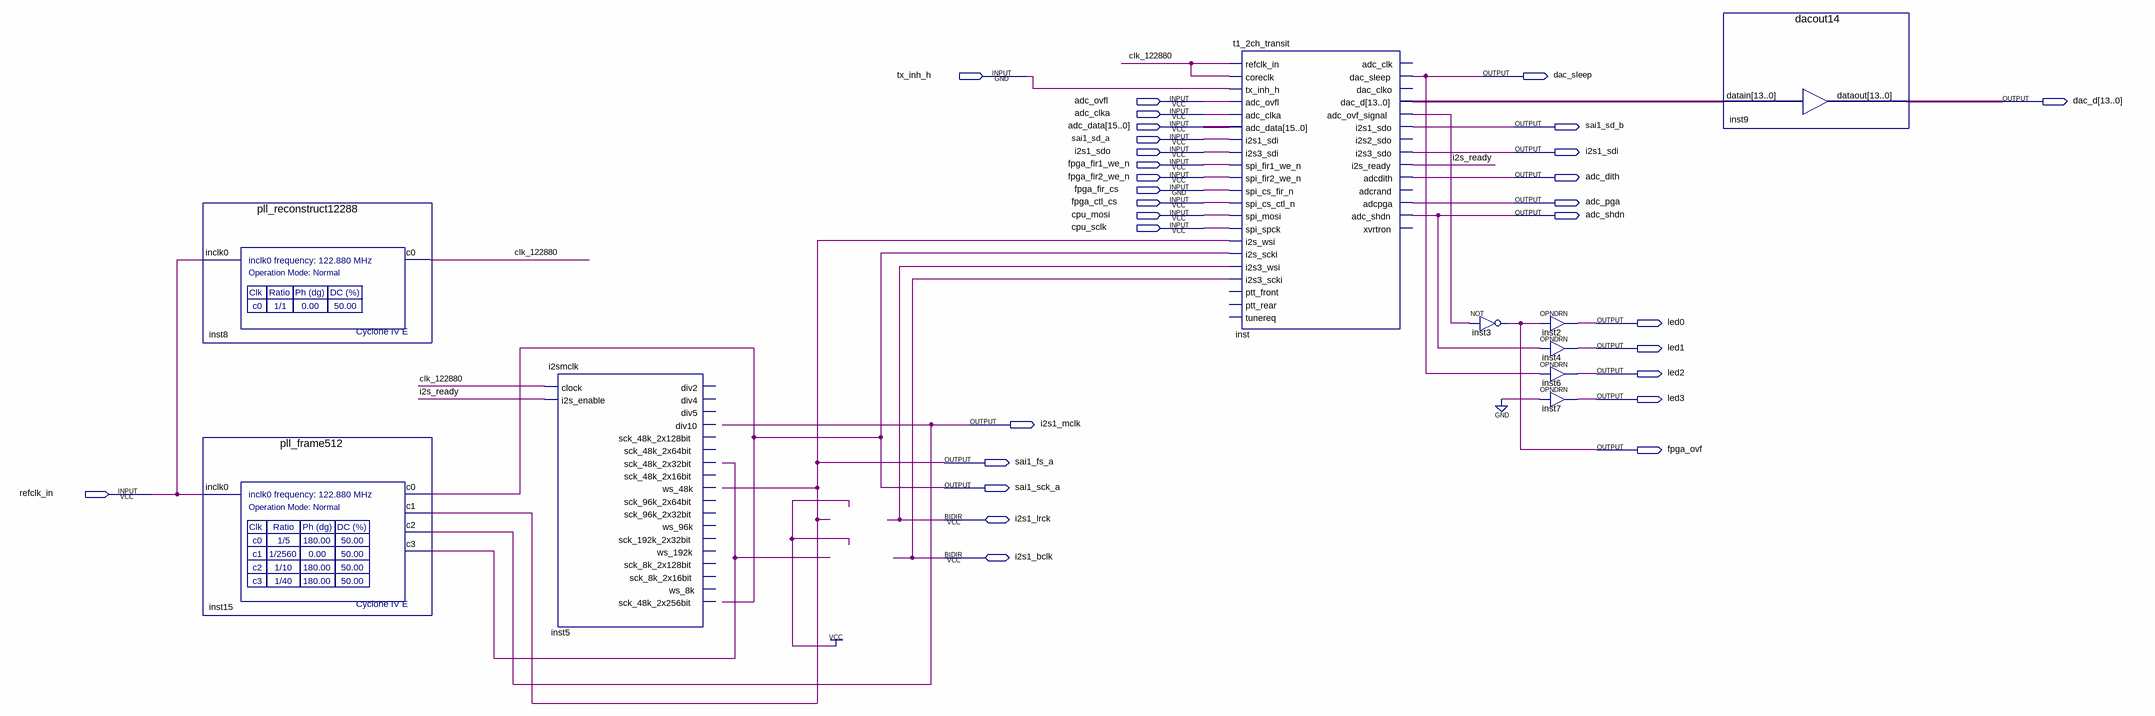
[diagram p0: schematic sheet]
// Quartus schematic tc1_top_veloci_v0.bdf as structural Verilog: 10 symbols, 30 pins
module tc1_top_veloci_v0 (
  input  tx_inh_h,
  input  adc_ovfl,
  input  adc_clka,
  input  [15:0] adc_data,
  input  sai1_sd_a,
  input  i2s1_sdo,
  input  fpga_fir1_we_n,
  input  fpga_fir2_we_n,
  input  fpga_fir_cs,
  input  fpga_ctl_cs,
  input  cpu_mosi,
  input  cpu_sclk,
  input  refclk_in,
  inout  i2s1_lrck,
  inout  i2s1_bclk,
  output dac_sleep,
  output [13:0] dac_d,
  output sai1_sd_b,
  output i2s1_sdi,
  output adc_dith,
  output adc_pga,
  output adc_shdn,
  output led0,
  output led1,
  output led2,
  output led3,
  output i2s1_mclk,
  output fpga_ovf,
  output sai1_fs_a,
  output sai1_sck_a
);

  wire clk_122880, i2s_ready, inst15_c3, inst_adc_ovf_signal;
  wire [13:0] inst_dac_d;

  pll_reconstruct12288 inst8 (.inclk0(refclk_in), .c0(clk_122880));
  pll_frame512 inst15 (.inclk0(refclk_in), .c0(sai1_sck_a), .c1(sai1_fs_a), .c2(i2s1_mclk), .c3(inst15_c3));
  i2smclk inst5 (
    .clock(clk_122880), .i2s_enable(i2s_ready));  // open: div2, div4, div5, div10, sck_48k_2x128bit, sck_48k_2x64bit, sck_48k_2x32bit, sck_48k_2x16bit, ws_48k, sck_96k_2x64bit, sck_96k_2x32bit, ws_96k, sck_192k_2x32bit, ws_192k, sck_8k_2x128bit, sck_8k_2x16bit, ws_8k, sck_48k_2x256bit
  t1_2ch_transit inst (
    .refclk_in(clk_122880), .coreclk(clk_122880), .tx_inh_h(tx_inh_h), .adc_ovfl(adc_ovfl),
    .adc_clka(adc_clka), .adc_data(adc_data), .i2s1_sdi(sai1_sd_a), .i2s3_sdi(i2s1_sdo),
    .spi_fir1_we_n(fpga_fir1_we_n), .spi_fir2_we_n(fpga_fir2_we_n), .spi_cs_fir_n(fpga_fir_cs),
    .spi_cs_ctl_n(fpga_ctl_cs), .spi_mosi(cpu_mosi), .spi_spck(cpu_sclk), .i2s_wsi(sai1_fs_a),
    .i2s_scki(sai1_sck_a), .i2s3_wsi(i2s1_lrck), .i2s3_scki(i2s1_bclk), .dac_sleep(dac_sleep),
    .dac_d(inst_dac_d), .adc_ovf_signal(inst_adc_ovf_signal), .i2s1_sdo(sai1_sd_b), .i2s3_sdo(i2s1_sdi),
    .i2s_ready(i2s_ready), .adcdith(adc_dith), .adcpga(adc_pga), .adc_shdn(adc_shdn));  // open: ptt_front, ptt_rear, tunereq, adc_clk, dac_clko, i2s2_sdo, adcrand, xvrtron
  not inst3 (fpga_ovf, inst_adc_ovf_signal);
  OPNDRN inst2 (.IN(fpga_ovf), .OUT(led0));
  OPNDRN inst4 (.IN(adc_shdn), .OUT(led1));
  OPNDRN inst6 (.IN(dac_sleep), .OUT(led2));
  OPNDRN inst7 (.IN(1'b0), .OUT(led3));
  dacout14 inst9 (.datain(inst_dac_d), .dataout(dac_d));
endmodule
